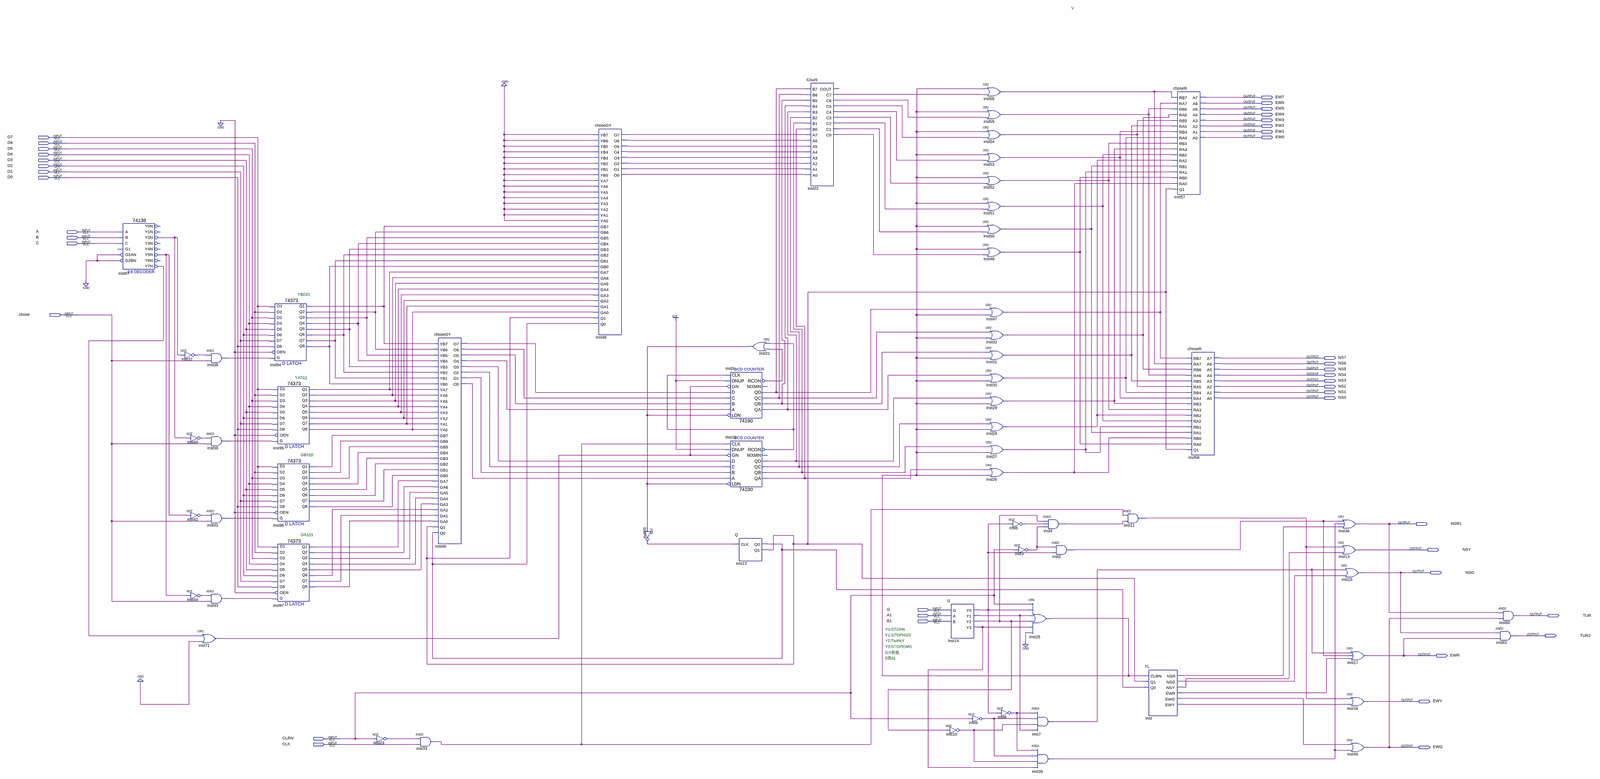
[diagram p0: schematic sheet, whole]
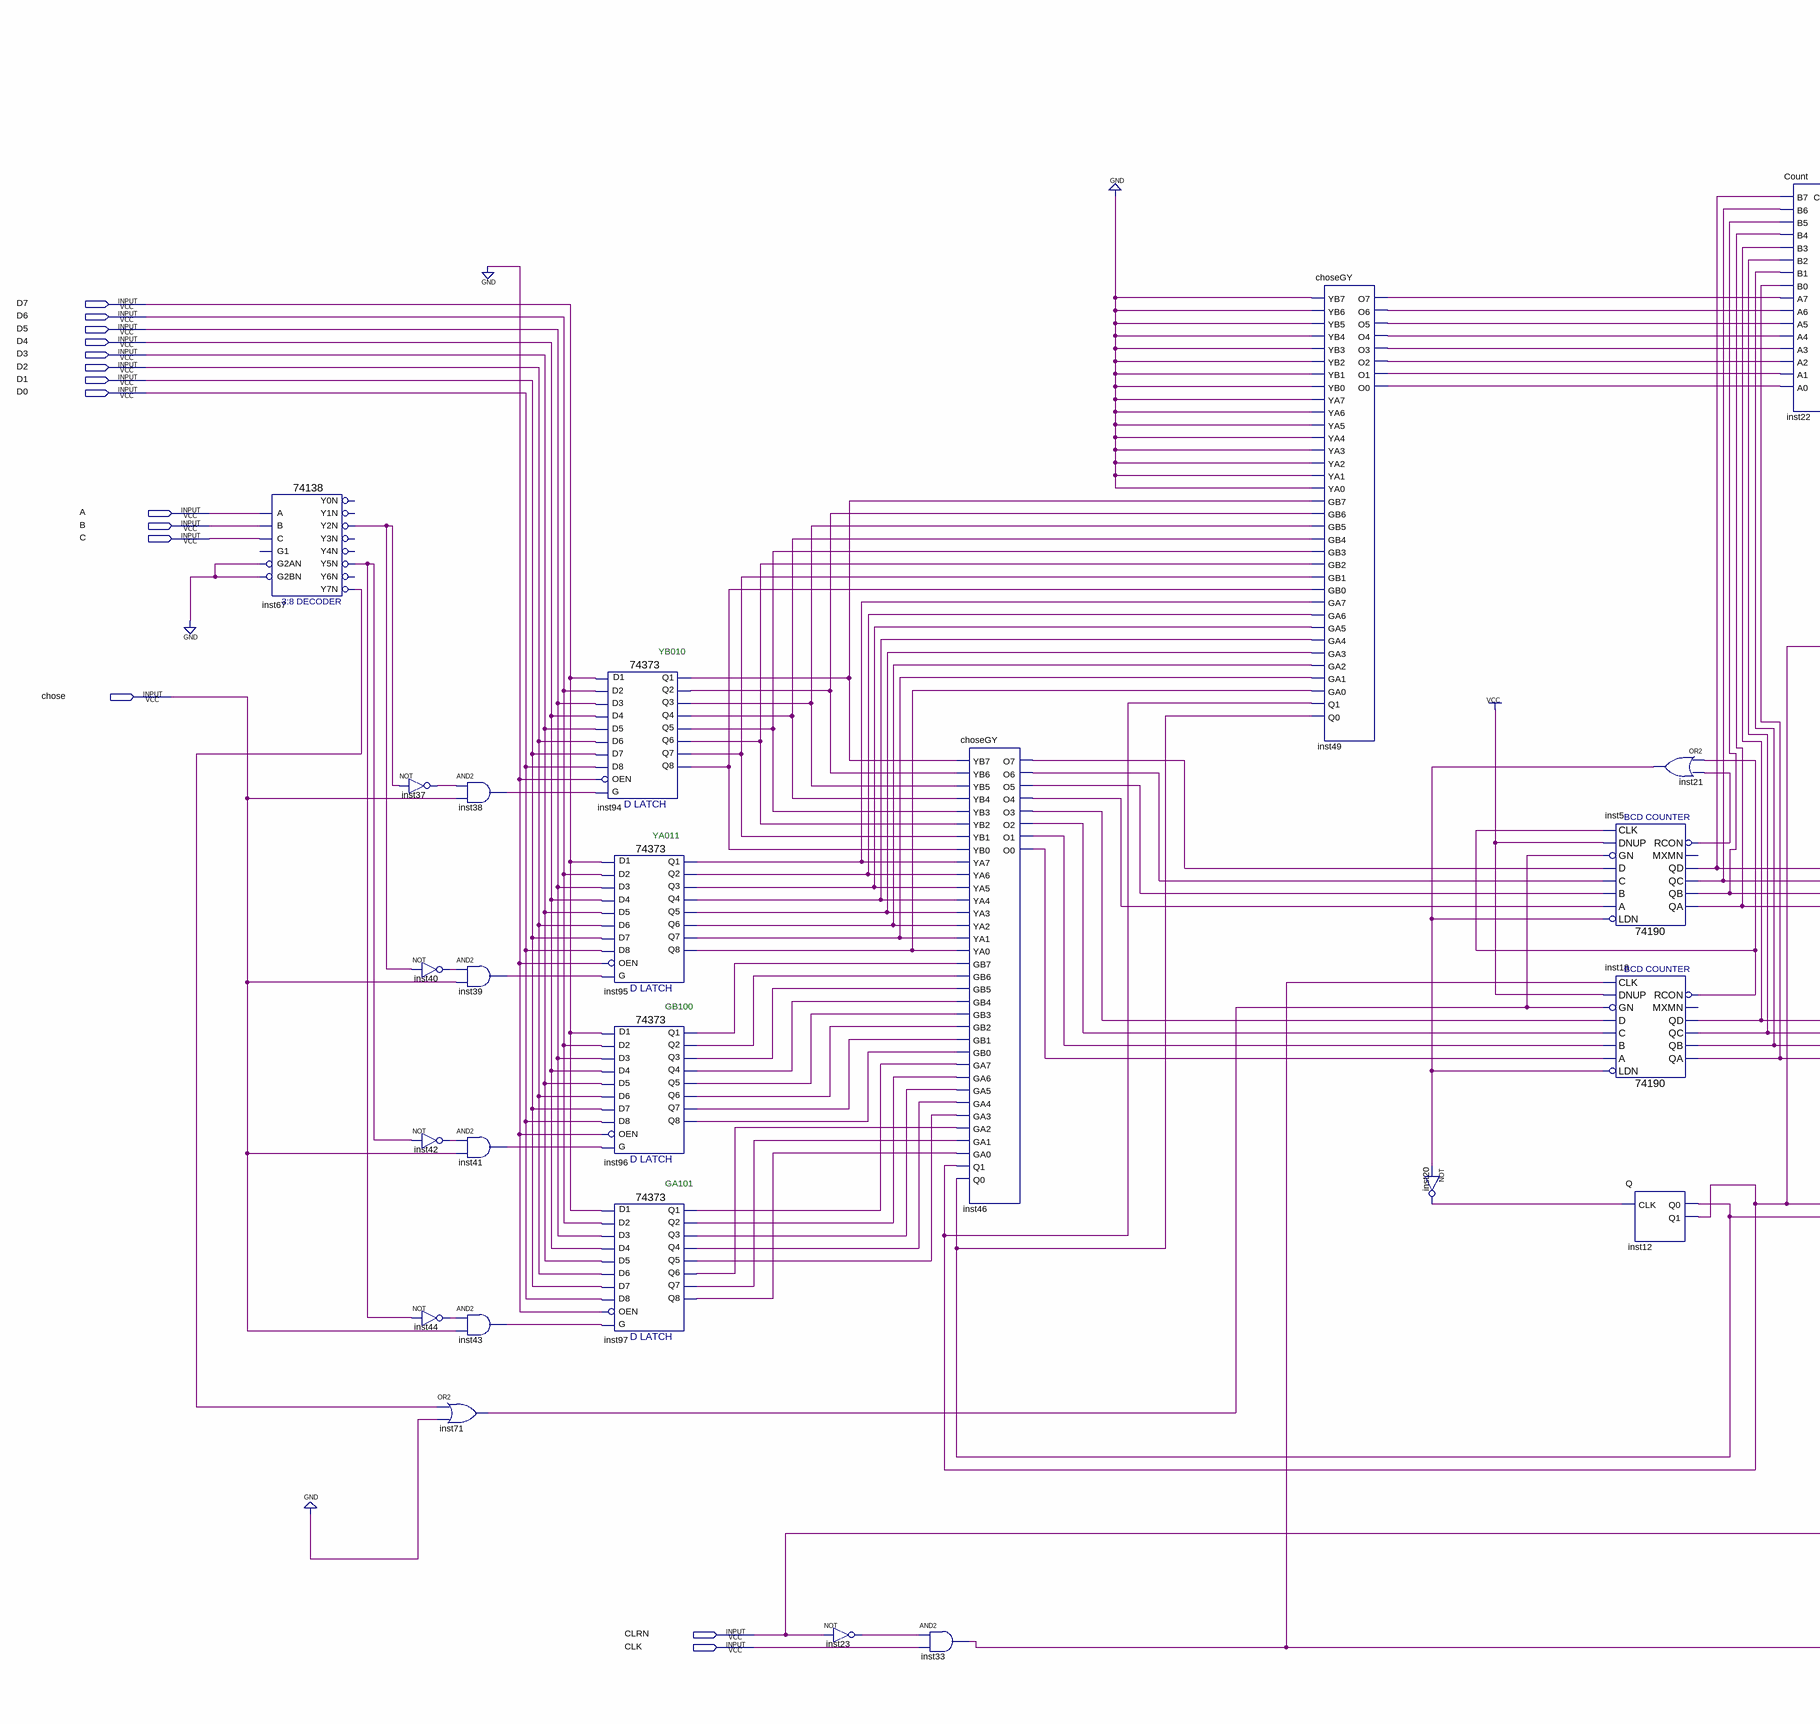
[diagram p1: schematic sheet, left part]
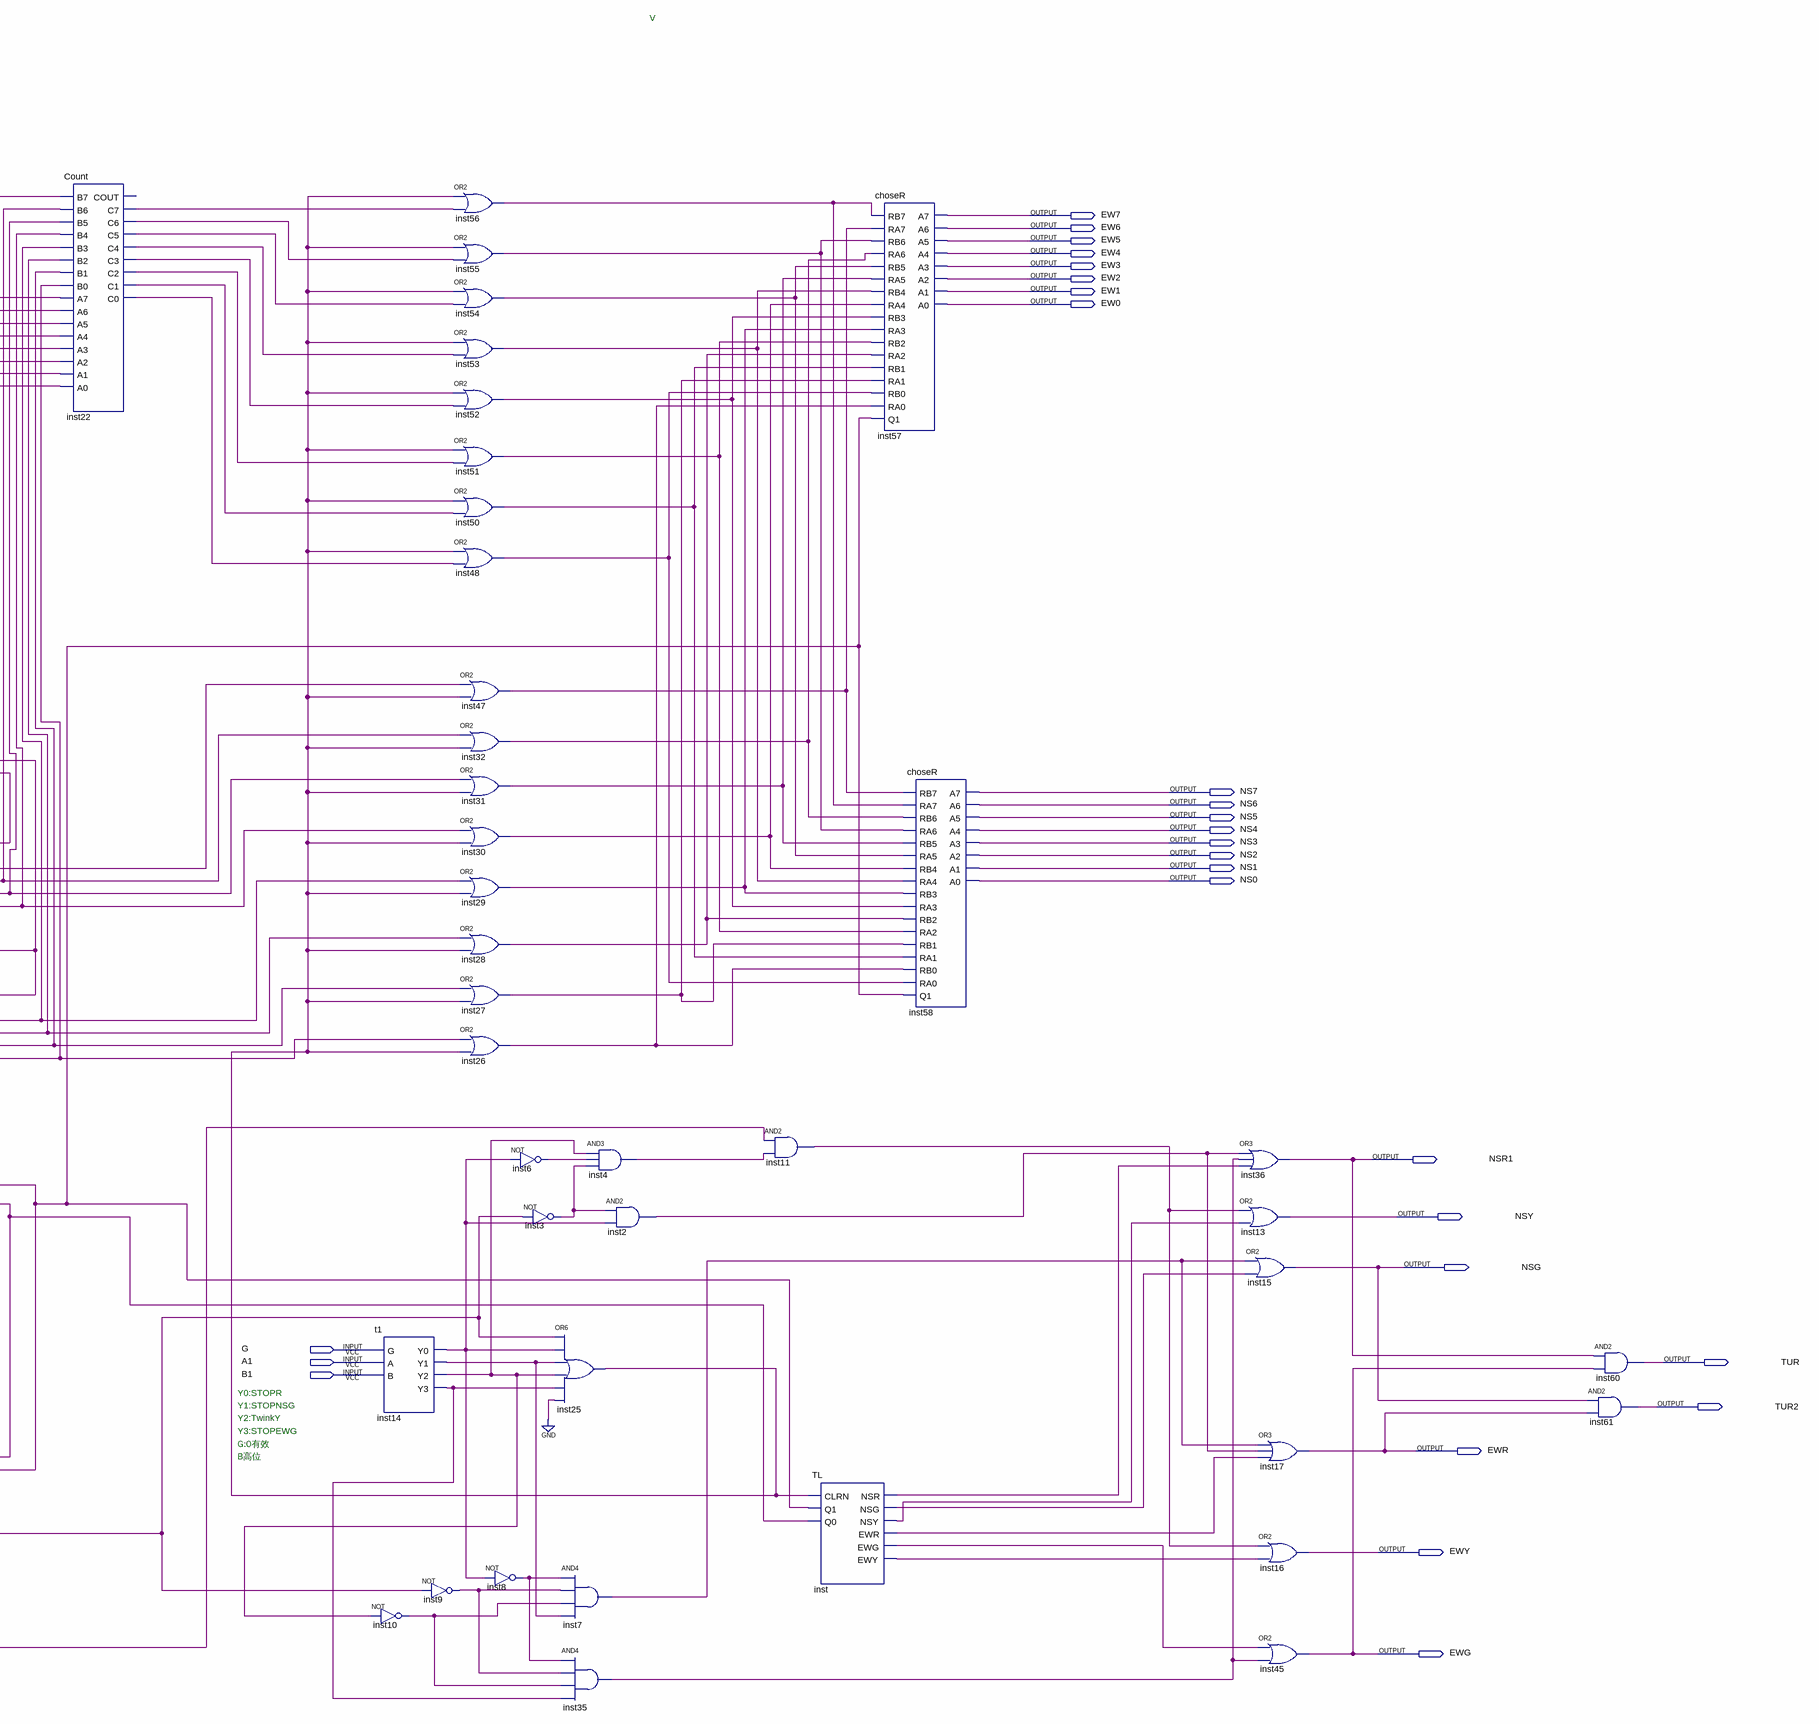
[diagram p2: schematic sheet, right part]
// Quartus schematic Tlingt.bdf as structural Verilog: 63 symbols, 41 pins
module Tlingt (
  input  D7,
  input  D6,
  input  D5,
  input  D4,
  input  D3,
  input  D2,
  input  D1,
  input  D0,
  input  A,
  input  B,
  input  C,
  input  chose,
  input  G,
  input  A1,
  input  B1,
  input  CLRN,
  input  CLK,
  output EW7,
  output EW6,
  output EW5,
  output EW4,
  output EW3,
  output EW2,
  output EW1,
  output EW0,
  output NS7,
  output NS6,
  output NS5,
  output NS4,
  output NS3,
  output NS2,
  output NS1,
  output NS0,
  output NSR1,
  output NSY,
  output NSG,
  output TUR,
  output TUR2,
  output EWR,
  output EWY,
  output EWG
);

  wire inst2_out, inst3_out, inst4_out, inst5_qa, inst5_qb, inst5_qc, inst5_qd, inst5_rcon, inst6_out,
       inst7_out, inst8_out, inst9_out, inst10_out, inst11_out, inst12_q0, inst12_q1, inst14_y0, inst14_y1,
       inst14_y2, inst14_y3, inst18_qa, inst18_qb, inst18_qc, inst18_qd, inst18_rcon, inst20_out, inst21_out,
       inst22_c0, inst22_c1, inst22_c2, inst22_c3, inst22_c4, inst22_c5, inst22_c6, inst22_c7, inst23_out,
       inst25_out, inst26_out, inst27_out, inst28_out, inst29_out, inst30_out, inst31_out, inst32_out,
       inst33_out, inst35_out, inst37_out, inst38_out, inst39_out, inst40_out, inst41_out, inst42_out,
       inst43_out, inst44_out, inst46_o0, inst46_o1, inst46_o2, inst46_o3, inst46_o4, inst46_o5, inst46_o6,
       inst46_o7, inst47_out, inst48_out, inst49_o0, inst49_o1, inst49_o2, inst49_o3, inst49_o4, inst49_o5,
       inst49_o6, inst49_o7, inst50_out, inst51_out, inst52_out, inst53_out, inst54_out, inst55_out,
       inst56_out, inst67_y2n, inst67_y5n, inst67_y7n, inst71_out, inst94_q1, inst94_q2, inst94_q3,
       inst94_q4, inst94_q5, inst94_q6, inst94_q7, inst94_q8, inst95_q1, inst95_q2, inst95_q3, inst95_q4,
       inst95_q5, inst95_q6, inst95_q7, inst95_q8, inst96_q1, inst96_q2, inst96_q3, inst96_q4, inst96_q5,
       inst96_q6, inst96_q7, inst96_q8, inst97_q1, inst97_q2, inst97_q3, inst97_q4, inst97_q5, inst97_q6,
       inst97_q7, inst97_q8, inst_ewg, inst_ewr, inst_ewy, inst_nsg, inst_nsr, inst_nsy;

  \74138  inst67 (
    .A(A), .B(B), .C(C), .G2AN(1'b0), .G2BN(1'b0), .Y2N(inst67_y2n), .Y5N(inst67_y5n), .Y7N(inst67_y7n));  // open: G1, Y0N, Y1N, Y3N, Y4N, Y6N
  not inst37 (inst37_out, inst67_y2n);
  not inst40 (inst40_out, inst67_y2n);
  not inst42 (inst42_out, inst67_y5n);
  not inst44 (inst44_out, inst67_y5n);
  or inst71 (inst71_out, inst67_y7n, 1'b0);
  and inst38 (inst38_out, inst37_out, chose);
  and inst39 (inst39_out, inst40_out, chose);
  and inst41 (inst41_out, inst42_out, chose);
  and inst43 (inst43_out, inst44_out, chose);
  \74373  inst94 (
    .D1(D7), .D3(D5), .D6(D2), .D7(D1), .D2(D6), .G(inst38_out), .D4(D4), .D5(D3), .D8(D0), .OEN(1'b0),
    .Q3(inst94_q3), .Q6(inst94_q6), .Q7(inst94_q7), .Q2(inst94_q2), .Q8(inst94_q8), .Q4(inst94_q4),
    .Q5(inst94_q5), .Q1(inst94_q1));
  \74373  inst95 (
    .D1(D7), .D3(D5), .D6(D2), .D7(D1), .D2(D6), .G(inst39_out), .D4(D4), .D5(D3), .D8(D0), .OEN(1'b0),
    .Q3(inst95_q3), .Q6(inst95_q6), .Q7(inst95_q7), .Q2(inst95_q2), .Q8(inst95_q8), .Q4(inst95_q4),
    .Q5(inst95_q5), .Q1(inst95_q1));
  \74373  inst96 (
    .D1(D7), .D3(D5), .D6(D2), .D7(D1), .D2(D6), .G(inst41_out), .D4(D4), .D5(D3), .D8(D0), .OEN(1'b0),
    .Q3(inst96_q3), .Q6(inst96_q6), .Q7(inst96_q7), .Q2(inst96_q2), .Q8(inst96_q8), .Q4(inst96_q4),
    .Q5(inst96_q5), .Q1(inst96_q1));
  \74373  inst97 (
    .D1(D7), .D3(D5), .D6(D2), .D7(D1), .D2(D6), .G(inst43_out), .D4(D4), .D5(D3), .D8(D0), .OEN(1'b0),
    .Q3(inst97_q3), .Q6(inst97_q6), .Q7(inst97_q7), .Q2(inst97_q2), .Q8(inst97_q8), .Q4(inst97_q4),
    .Q5(inst97_q5), .Q1(inst97_q1));
  not inst23 (inst23_out, CLRN);
  and inst33 (inst33_out, inst23_out, CLK);
  choseGY inst46 (
    .YB7(inst94_q1), .YB6(inst94_q2), .YB5(inst94_q3), .YB4(inst94_q4), .YB3(inst94_q5), .YB2(inst94_q6),
    .YB1(inst94_q7), .YB0(inst94_q8), .YA7(inst95_q1), .YA6(inst95_q2), .YA5(inst95_q3), .YA4(inst95_q4),
    .YA3(inst95_q5), .YA2(inst95_q6), .YA1(inst95_q7), .YA0(inst95_q8), .GB7(inst96_q1), .GB6(inst96_q2),
    .GB5(inst96_q3), .GB4(inst96_q4), .GB3(inst96_q5), .GB2(inst96_q6), .GB1(inst96_q7), .GB0(inst96_q8),
    .GA7(inst97_q1), .GA6(inst97_q2), .GA5(inst97_q3), .GA4(inst97_q4), .GA3(inst97_q5), .GA2(inst97_q6),
    .GA1(inst97_q7), .GA0(inst97_q8), .Q1(inst12_q1), .Q0(inst12_q0), .O7(inst46_o7), .O6(inst46_o6),
    .O5(inst46_o5), .O4(inst46_o4), .O3(inst46_o3), .O2(inst46_o2), .O1(inst46_o1), .O0(inst46_o0));
  choseGY inst49 (
    .YB7(1'b0), .YB6(1'b0), .YB5(1'b0), .YB4(1'b0), .YB3(1'b0), .YB2(1'b0), .YB1(1'b0), .YB0(1'b0),
    .YA7(1'b0), .YA6(1'b0), .YA5(1'b0), .YA4(1'b0), .YA3(1'b0), .YA2(1'b0), .YA1(1'b0), .YA0(1'b0),
    .GB7(inst94_q1), .GB6(inst94_q2), .GB5(inst94_q3), .GB4(inst94_q4), .GB3(inst94_q5), .GB2(inst94_q6),
    .GB1(inst94_q7), .GB0(inst94_q8), .GA7(inst95_q1), .GA6(inst95_q2), .GA5(inst95_q3), .GA4(inst95_q4),
    .GA3(inst95_q5), .GA2(inst95_q6), .GA1(inst95_q7), .GA0(inst95_q8), .Q1(inst12_q1), .Q0(inst12_q0),
    .O7(inst49_o7), .O6(inst49_o6), .O5(inst49_o5), .O4(inst49_o4), .O3(inst49_o3), .O2(inst49_o2),
    .O1(inst49_o1), .O0(inst49_o0));
  not inst20 (inst20_out, inst21_out);
  \74190  inst5 (
    .LDN(inst21_out), .A(inst46_o4), .C(inst46_o6), .B(inst46_o5), .D(inst46_o7), .GN(inst71_out),
    .CLK(inst18_rcon), .DNUP(1'b1), .QA(inst5_qa), .QB(inst5_qb), .QD(inst5_qd), .QC(inst5_qc),
    .RCON(inst5_rcon));  // open: MXMN
  \74190  inst18 (
    .LDN(inst21_out), .A(inst46_o0), .C(inst46_o2), .B(inst46_o1), .D(inst46_o3), .GN(inst71_out),
    .CLK(inst33_out), .DNUP(1'b1), .QA(inst18_qa), .QB(inst18_qb), .QD(inst18_qd), .QC(inst18_qc),
    .RCON(inst18_rcon));  // open: MXMN
  or inst21 (inst21_out, inst18_rcon, inst5_rcon);
  Q inst12 (.CLK(inst20_out), .Q0(inst12_q0), .Q1(inst12_q1));
  Count inst22 (
    .B7(inst5_qd), .B6(inst5_qc), .B5(inst5_qb), .B4(inst5_qa), .B3(inst18_qd), .B2(inst18_qc),
    .B1(inst18_qb), .B0(inst18_qa), .A7(inst49_o7), .A6(inst49_o6), .A5(inst49_o5), .A4(inst49_o4),
    .A3(inst49_o3), .A2(inst49_o2), .A1(inst49_o1), .A0(inst49_o0), .C7(inst22_c7), .C6(inst22_c6),
    .C5(inst22_c5), .C4(inst22_c4), .C3(inst22_c3), .C2(inst22_c2), .C1(inst22_c1), .C0(inst22_c0));  // open: COUT
  t1 inst14 (.G(G), .A(A1), .B(B1), .Y0(inst14_y0), .Y1(inst14_y1), .Y2(inst14_y2), .Y3(inst14_y3));
  not inst10 (inst10_out, inst14_y2);
  not inst9 (inst9_out, CLRN);
  or inst56 (inst56_out, inst25_out, inst22_c7);
  or inst55 (inst55_out, inst25_out, inst22_c6);
  or inst54 (inst54_out, inst25_out, inst22_c5);
  or inst53 (inst53_out, inst25_out, inst22_c4);
  or inst52 (inst52_out, inst25_out, inst22_c3);
  or inst51 (inst51_out, inst25_out, inst22_c2);
  or inst50 (inst50_out, inst25_out, inst22_c1);
  or inst48 (inst48_out, inst25_out, inst22_c0);
  or inst47 (inst47_out, inst5_qd, inst25_out);
  or inst32 (inst32_out, inst5_qc, inst25_out);
  or inst31 (inst31_out, inst5_qb, inst25_out);
  or inst30 (inst30_out, inst5_qa, inst25_out);
  or inst29 (inst29_out, inst18_qd, inst25_out);
  or inst28 (inst28_out, inst18_qc, inst25_out);
  or inst27 (inst27_out, inst18_qb, inst25_out);
  or inst26 (inst26_out, inst18_qa, inst25_out);
  not inst8 (inst8_out, inst14_y0);
  not inst6 (inst6_out, inst14_y0);
  not inst3 (inst3_out, CLRN);
  and inst4 (inst4_out, inst14_y2, inst6_out, inst3_out);
  or inst25 (inst25_out, CLRN, inst14_y0, inst14_y1, inst14_y2, inst14_y3, 1'b0);
  and inst7 (inst7_out, inst8_out, inst9_out, inst10_out, inst14_y1);
  and inst35 (inst35_out, inst8_out, inst9_out, inst10_out, inst14_y3);
  and inst2 (inst2_out, inst3_out, inst14_y0);
  and inst11 (inst11_out, inst33_out, inst4_out);
  TL inst (
    .CLRN(inst25_out), .Q1(inst12_q1), .Q0(inst12_q0), .NSR(inst_nsr), .NSG(inst_nsg), .NSY(inst_nsy),
    .EWR(inst_ewr), .EWG(inst_ewg), .EWY(inst_ewy));
  choseR inst57 (
    .RB7(inst56_out), .RA7(inst47_out), .RB6(inst55_out), .RA6(inst32_out), .RB5(inst54_out),
    .RA5(inst31_out), .RB4(inst53_out), .RA4(inst30_out), .RB3(inst52_out), .RA3(inst29_out),
    .RB2(inst51_out), .RA2(inst28_out), .RB1(inst50_out), .RA1(inst27_out), .RB0(inst48_out),
    .RA0(inst26_out), .Q1(inst12_q1), .A7(EW7), .A6(EW6), .A5(EW5), .A4(EW4), .A3(EW3), .A2(EW2), .A1(EW1),
    .A0(EW0));
  choseR inst58 (
    .RB7(inst47_out), .RA7(inst56_out), .RB6(inst32_out), .RA6(inst55_out), .RB5(inst31_out),
    .RA5(inst54_out), .RB4(inst30_out), .RA4(inst53_out), .RB3(inst29_out), .RA3(inst52_out),
    .RB2(inst28_out), .RA2(inst51_out), .RB1(inst27_out), .RA1(inst50_out), .RB0(inst26_out),
    .RA0(inst48_out), .Q1(inst12_q1), .A7(NS7), .A6(NS6), .A5(NS5), .A4(NS4), .A3(NS3), .A2(NS2), .A1(NS1),
    .A0(NS0));
  or inst36 (NSR1, inst2_out, inst35_out, inst_nsr);
  or inst13 (NSY, inst11_out, inst_nsy);
  or inst15 (NSG, inst7_out, inst_nsg);
  or inst17 (EWR, inst7_out, inst2_out, inst_ewr);
  or inst16 (EWY, inst11_out, inst_ewy);
  or inst45 (EWG, inst_ewg, inst35_out);
  and inst60 (TUR, NSR1, EWG);
  and inst61 (TUR2, NSG, EWR);

  // Notes on the sheet:
  //   V
  //   YB010
  //   YA011
  //   GB100
  //   GA101
  //   Y0:STOPR
  //   Y1:STOPNSG
  //   Y2:TwinkY
  //   Y3:STOPEWG
  //   G:0有效
  //   B高位
endmodule
